# Altium schematic sheet DiPho_AFE.SchDoc: DiPho AFE
size 420 x 297 mm; Author: P. Daniel; CompanyName: WUT ISE; DrawnBy: P. Daniel; Organization: WUT ISE; Address1: WUT ISE; Address2: Nowowiejska 15/19 00-665 Warsaw; Address3: piotrmaciejdaniel@gmail.com; Revision: 2; SheetNumber: 1; SheetTotal: 3; ModifiedBy: -; CreateDate: 10-12.2021; CheckedDate: -; Title2: top schematic; DivGrp: WUT ISE; Designer: Piotr Daniel; ModifiedDate: -; ProjectName: Sensor Box
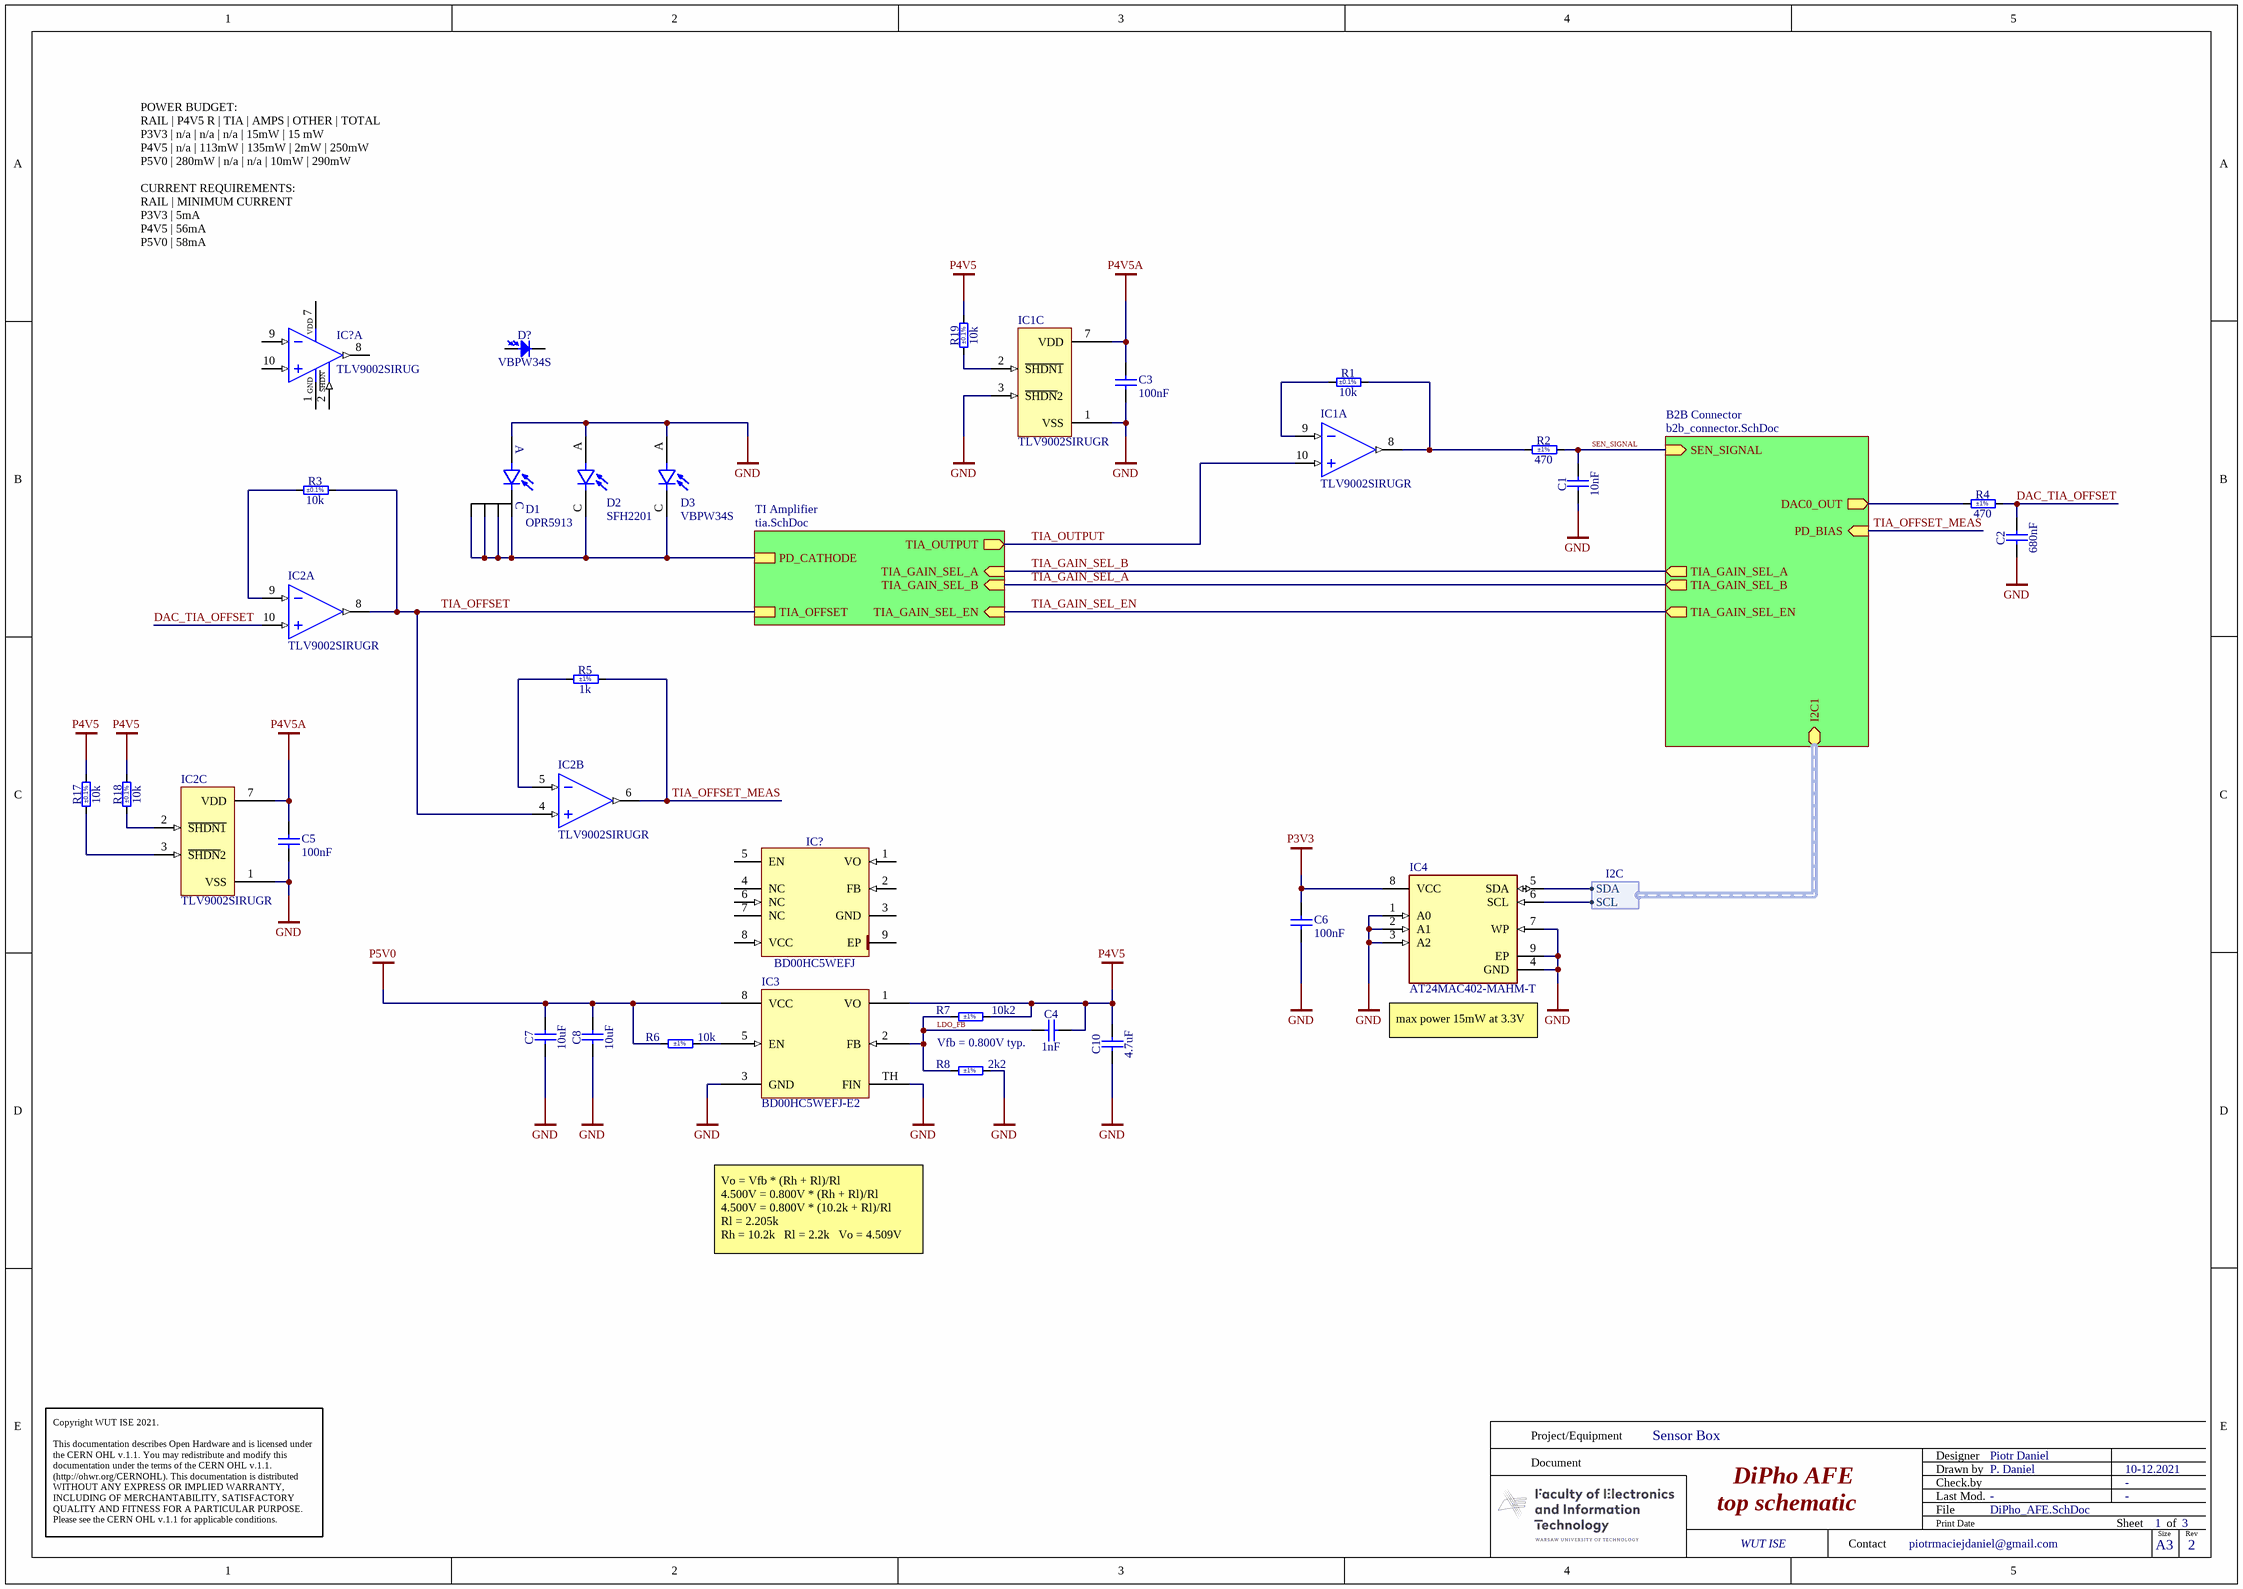
[diagram p0: DiPho_AFE.SchDoc]

## Parts
(Parts that share a designator on the sheet are numbered #1, #2 ... from top to bottom, then left to right.)
C1  10nF  [CAPC1005X55N]
C2  680nF  [CAPC1005X55N]
C3  100nF  [CAPC1005X55N]
C4  1nF  [CAPC1005X55N]
C5  100nF  [CAPC1005X55N]
C6  100nF  [CAPC1005X55N]
C7  10uF  [CAPC2012X135N]
C8  10uF  [CAPC2012X135N]
C10  4.7uF  [CAPC1709X95N]
D1  OPR5913  [LCCS249P899X899X167-8N]
D2  SFH2201  [SFH_2201]
D3  VBPW34S  [SOT0P705X130-2M]
D?  VBPW34S  [VISHAY_VBPW34S]
IC1  TLV9002SIRUGR  [QFN50P150X200X40-10N]  (parts A,C of 3)
IC2  TLV9002SIRUGR  [QFN50P150X200X40-10N]  (parts A,B,C of 3)
IC3  BD00HC5WEFJ-E2  [TSOP127P600X100_HS-9L]
IC4  AT24MAC402-MAHM-T  [FP-C04-21355-Q4B-MFG]
IC?#1  TLV9002SIRUG  [TEXAS_RUG (R-PQFP-N10)]  (part A of 2)
IC?#2  BD00HC5WEFJ  [SOIC127P600X170-9N-R240X310]
R1  10k  Tolerance: ±0.1%  [RESC1005X35N]
R2  470  Tolerance: ±1%  [RESC1005X40N]
R3  10k  Tolerance: ±0.1%  [RESC1005X35N]
R4  470  Tolerance: ±1%  [RESC1005X40N]
R5  1k  Tolerance: ±1%  [RESC1005X40N]
R6  10k  Tolerance: ±1%  [RESC1005X40N]
R7  10k2  Tolerance: ±1%  [RESC1005X40N]
R8  2k2  Tolerance: ±1%  [RESC1005X40N]
R17  10k  Tolerance: ±0.1%  [RESC1005X35N]
R18  10k  Tolerance: ±0.1%  [RESC1005X35N]
R19  10k  Tolerance: ±0.1%  [RESC1005X35N]

## Sub-sheets
B2B Connector = b2b_connector.SchDoc: TIA_GAIN_SEL_A (out), TIA_GAIN_SEL_B (out), I2C1 (bidir, harness I2C), TIA_GAIN_SEL_EN (out), SEN_SIGNAL (in), DAC0_OUT (out), PD_BIAS (in)
TI Amplifier = tia.SchDoc: PD_CATHODE, TIA_OUTPUT (out), TIA_GAIN_SEL_A (in), TIA_GAIN_SEL_B (in), TIA_OFFSET, TIA_GAIN_SEL_EN (in)

## Harnesses
I2C: SCL, SDA

## Nets
GND: C1.1 C2.1 C3.1 C5.1 C6.1 C7.1 C8.1 C10.1 D1.1(A) D2.A D3.A IC1.1(VSS) IC1.3(~{SHDN}2) IC2.1(VSS) IC3.3(GND) IC3.TH(FIN) IC4.1(A0) IC4.2(A1) IC4.3(A2) IC4.4(GND) IC4.7(WP) IC4.9(EP) R8.2
P3V3: C6.2 IC4.8(VCC)
P4V5: C4.2 C10.2 IC3.1(VO) R7.2 R17.2 R18.2 R19.2
P4V5A: C3.2 C5.2 IC1.7(VDD) IC2.7(VDD)
P5V0: C7.2 C8.2 IC3.8(VCC) R6.1
DAC_TIA_OFFSET: C2.2 IC2.10(IN+) R4.2
LDO_FB: C4.1 IC3.2(FB) R7.1 R8.1
SEN_SIGNAL: C1.2 R2.2 ; sheet B2B Connector/SEN_SIGNAL
TIA_GAIN_SEL_A: sheet TI Amplifier/TIA_GAIN_SEL_B, sheet B2B Connector/TIA_GAIN_SEL_B
TIA_GAIN_SEL_B: sheet TI Amplifier/TIA_GAIN_SEL_A, sheet B2B Connector/TIA_GAIN_SEL_A
TIA_GAIN_SEL_EN: sheet TI Amplifier/TIA_GAIN_SEL_EN, sheet B2B Connector/TIA_GAIN_SEL_EN
TIA_OFFSET: IC2.4(IN+) IC2.8(OUT) R3.2 ; sheet TI Amplifier/TIA_OFFSET
TIA_OFFSET_MEAS: IC2.6(OUT) R5.2 ; sheet B2B Connector/PD_BIAS
TIA_OUTPUT: IC1.10(IN+) ; sheet TI Amplifier/TIA_OUTPUT
NetD1_2: D1.2(C) D1.3(C) D1.6(C) D1.7(C) D2.C D3.C ; sheet TI Amplifier/PD_CATHODE
NetIC1_2: IC1.2(~{SHDN1}) R19.1
NetIC1_8: IC1.8(OUT) R1.2 R2.1
NetIC1_9: IC1.9(IN-) R1.1
NetIC2_2: IC2.2(~{SHDN1}) R18.1
NetIC2_3: IC2.3(~{SHDN}2) R17.1
NetIC2_5: IC2.5(IN-) R5.1
NetIC2_9: IC2.9(IN-) R3.1
NetIC3_5: IC3.5(EN) R6.2
NetIC4_5: IC4.5(SDA) ; sheet B2B Connector/I2C1.SDA
NetIC4_6: IC4.6(SCL) ; sheet B2B Connector/I2C1.SCL
NetR4_1: R4.1 ; sheet B2B Connector/DAC0_OUT

Not connected (* = marked no-connect by the designer): D? 1(C) 2(A); IC?#1 1(V-) 2(~{SHDN1}) 7(V+) 8(OUT1) 9(IN1-) 10(IN1+); IC?#2 1(VO) 2(FB) 3(GND) 4(NC) 5(EN) 6(NC) 7(NC) 8(VCC) 9(EP)

## Notes on the sheet
- POWER BUDGET:
  RAIL	| P4V5 R	| TIA	| AMPS	| OTHER	| TOTAL
  P3V3	| n/a	| n/a	| n/a	| 15mW	| 15 mW
  P4V5	| n/a	| 113mW	| 135mW	| 2mW	| 250mW
  P5V0	| 280mW	| n/a	| n/a	| 10mW	| 290mW
  CURRENT REQUIREMENTS:
  RAIL	| MINIMUM CURRENT
  P3V3	| 5mA
  P4V5	| 56mA
  P5V0	| 58mA
- (near C4) Vfb = 0.800V typ.
- (near IC4) max power 15mW at 3.3V
- Vo = Vfb * (Rh + Rl)/Rl
  4.500V = 0.800V * (Rh + Rl)/Rl
  4.500V = 0.800V * (10.2k + Rl)/Rl
  Rl = 2.205k
  Rh = 10.2k   Rl = 2.2k   Vo = 4.509V
- Project/Equipment
- Document
- Designer
- Drawn by
- Check.by
- Copyright WUT ISE 2021.
  This documentation describes Open Hardware and is licensed under the CERN OHL v.1.1. You may redistribute and modify this documentation under the terms of the CERN OHL v.1.1. (http://ohwr.org/CERNOHL). This documentation is distributed WITHOUT ANY EXPRESS OR IMPLIED WARRANTY, INCLUDING OF MERCHANTABILITY, SATISFACTORY QUALITY AND FITNESS FOR A PARTICULAR PURPOSE. Please see the CERN OHL v.1.1 for applicable conditions.
- Contact
- File
- Last Mod.
- Print Date
- Sheet
- Size
- A3
- of
- Rev
- (in symbol TLV9002SIRUG, part A) SHDN

## Library data of the parts
C1 = CC0402_10NF_16V_10%_X7R: Non-polarised capacitor; Part Description: SMD Multilayer Chip Ceramic Capacitor; Manufacturer: GENERIC; Manufacturer1 Part Number: 223878715636; Voltage: 16V; TC: X7R; Tolerance: ±10%; Part Number: CC0402_10NF_16V_10%_X7R; Component Kind: Standard; Component Type: Standard; Pin Count: 2; Value: 10nF; Status: Not Recommended; Manufacturer Part Number: CC0402_10NF_16V_10%_X7R; Case: 0402; Mounted: Yes; Socket: No; SMD: Yes; Sense: No; Manufacturer1 Example: PHYCOMP; Manufacturer1 ComponentHeight: 0.55mm; HelpURL: \\cern.ch\dfs\Applications\Altium\Datasheets\CC0402_X7R_PHYCOMP.pdf; Author: CERN DEM JLC; CreateDate: 03.12.2007; LatestRevisionDate: 03.12.2007
C2 = CC0402_680NF_10V_10%_X5R: Non-polarised capacitor; Part Description: SMD Multilayer Chip Ceramic Capacitor; Manufacturer: GENERIC; Manufacturer1 Part Number: GRM155R61A684KE15; Voltage: 10V; TC: X5R; Tolerance: ±10%; Part Number: CC0402_680NF_10V_10%_X5R; Component Kind: Standard; Component Type: Standard; Pin Count: 2; Value: 680nF; Status: None; Manufacturer Part Number: CC0402_680NF_10V_10%_X5R; Case: 0402; Mounted: Yes; Socket: No; SMD: Yes; Sense: No; Manufacturer1 Example: MURATA; Manufacturer1 ComponentHeight: 0.55mm; HelpURL: \\cern.ch\dfs\Applications\Altium\Datasheets\CC0402_X5R_MURATA_GRM.pdf; Author: CERN DEM BC; CreateDate: 19.04.2021; LatestRevisionDate: 19.04.2021
C3 C5 C6 = CC0402_100NF_16V_10%_X7R: Non-polarised capacitor; Manufacturer: GENERIC; Part Description: SMD Multilayer Chip Ceramic Capacitor; Manufacturer1 Part Number: GRM155R71C104KA88D; Tolerance: ±10%; Voltage: 16V; TC: X7R; Part Number: CC0402_100NF_16V_10%_X7R; Component Kind: Standard; Component Type: Standard; Pin Count: 2; Value: 100nF; Status: Not Recommended; Manufacturer Part Number: CC0402_100NF_16V_10%_X7R; Case: 0402; Mounted: Yes; Socket: No; SMD: Yes; Sense: No; Manufacturer1 Example: MURATA; Manufacturer1 ComponentHeight: 0.55mm; HelpURL: \\cern.ch\dfs\Applications\Altium\Datasheets\CC0402_X7R_MURATA_GRM.pdf; Author: CERN DEM JLC; CreateDate: 05.12.2013; LatestRevisionDate: 03.12.2007
C4 = CC0402_1NF_50V_10%_X7R: Non-polarised capacitor; Part Description: SMD Multilayer Chip Ceramic Capacitor; Manufacturer: GENERIC; Manufacturer1 Part Number: 223858715623; Voltage: 50V; TC: X7R; Tolerance: ±10%; Part Number: CC0402_1NF_50V_10%_X7R; Component Kind: Standard; Component Type: Standard; Pin Count: 2; Value: 1nF; Status: Not Recommended; Manufacturer Part Number: CC0402_1NF_50V_10%_X7R; Case: 0402; Mounted: Yes; Socket: No; SMD: Yes; Sense: No; Manufacturer1 Example: PHYCOMP; Manufacturer1 ComponentHeight: 0.55mm; HelpURL: \\cern.ch\dfs\Applications\Altium\Datasheets\CC0402_X7R_PHYCOMP.pdf; Author: CERN DEM JLC; CreateDate: 03.12.2007; LatestRevisionDate: 03.12.2007
C7 C8 = CC0805_10UF_10V_10%_X7R: Non-polarised capacitor; Part Description: SMD Multilayer Chip Ceramic Capacitor; Manufacturer: GENERIC; Manufacturer1 Part Number: GRM21BR71A106KE51L; Voltage: 10V; TC: X7R; Tolerance: ±10%; Part Number: CC0805_10UF_10V_10%_X7R; Component Kind: Standard; Component Type: Standard; Pin Count: 2; Value: 10uF; Status: Preferred; Manufacturer Part Number: CC0805_10UF_10V_10%_X7R; Case: 0805; Mounted: Yes; Socket: No; SMD: Yes; Sense: No; Manufacturer1 Example: MURATA; Manufacturer1 ComponentHeight: 1.35mm; HelpURL: \\cern.ch\dfs\Applications\Altium\Datasheets\CC0805_X7R_MURATA.pdf; Author: CERN DEM JLC; CreateDate: 30.04.2012; LatestRevisionDate: 30.04.2012
C10 = CC0603_4.7UF_16V_10%_X5R: Non-polarised capacitor; Part Description: SMD Multilayer Chip Ceramic Capacitor; Manufacturer: GENERIC; Manufacturer1 Part Number: EMK107ABJ475KA-T; Voltage: 16V; TC: X5R; Tolerance: ±10%; Part Number: CC0603_4.7UF_16V_10%_X5R; Component Kind: Standard; Component Type: Standard; Pin Count: 2; Value: 4.7uF; Status: None; Manufacturer Part Number: CC0603_4.7UF_16V_10%_X5R; Case: 0603; Mounted: Yes; Socket: No; SMD: Yes; Sense: No; Manufacturer1 Example: TAIYO YUDEN; Manufacturer1 ComponentHeight: 0.95mm; HelpURL: \\cern.ch\dfs\Applications\Altium\Datasheets\CC0603_X7R_TAIYO-YUDEN_HIGH-VALUE.pdf; Author: CERN DEM JLC; CreateDate: 16.12.2013; LatestRevisionDate: 16.09.2014
D1 = OPR5913: Surface mount PIN photodiode, SMD-8, RoHS; Manufacturer: TT Optek; Wavelength: 880nm; Dark Current: 100nA; Max Reverse Voltage (DC): 10V; Responsivity: 0.4A/W; Supplier 1: Newark; Manufacturer Part Number: OPR5913; RoHS: Yes; Category: Optical Sensors; Pricing 1: 1=17,31000, 10=16,18000, 25=15,70000, 50=14,18000, 100=13,35000, 250=11,75000 (USD); Mount: Surface Mount; Case/Package: SMD/SMT; Number of Pins: 8; Min Operating Temperature: -55°C; Max Operating Temperature: 125°C; Packaging: Tray; Package Quantity: 25; Diode Type: PIN; Reverse Voltage: 10V; RoHS Compliant: Yes; ComponentLink1URL: https://datasheet.ciiva.com/2820/opr5910-5913-5915-2820071.pdf?src-supplier=Digi-Key; ComponentLink1Description: https://datasheet.ciiva.com/2820/opr5910-5913-5915-2820071.pdf?src-supplier=Digi-Key; Supplier Part Number 1: 09AK6399
D3 = VBPW34S: IR-photodiode Photoelectric current: 45...55 uA Wavelength of max. photosensitivity: 940 nm; Manufacturer: Vishay; Wavelength: 940nm; Rise Time: 100ns; Dark Current: 2nA; Viewing Angle: 130°; Reverse Breakdown Voltage: 60V; Power Dissipation: 215mW; Diode Type: PIN; Forward Voltage: 1.3V; Forward Current: 50mA; Supplier 1: Farnell; Manufacturer Part Number: VBPW34S; RoHS: Yes; Category: Photodiodes; Mount: Surface Mount,PCB; Case/Package: SMD/SMT; Number of Pins: 2; Contact Plating: Tin; Min Operating Temperature: -40°C; Max Operating Temperature: 100°C; Packaging: Tape and Reel; Fall Time: 100ns; Package Quantity: 1; Max Reverse Voltage (DC): 60V; Response Time: 100ns; Max Power Dissipation: 215mW; Reverse Voltage (DC): 60V; Series: -; Breakdown Voltage: 60V; Length: 4.4mm; Width: 3.9mm; Height: 1.2mm; Radiation Hardening: No; REACH SVHC: Unknown; RoHS Compliant: Yes; Lead Free: Lead Free; ComponentLink1URL: https://datasheet.ciiva.com/2819/vbpw34s-2819712.pdf?src-supplier=Digi-Key; ComponentLink1Description: https://datasheet.ciiva.com/2819/vbpw34s-2819712.pdf?src-supplier=Digi-Key; ComponentLink2URL: https://datasheet.ciiva.com/1336/485095-1336336.pdf?src-supplier=Newark; ComponentLink2Description: https://datasheet.ciiva.com/1336/485095-1336336.pdf?src-supplier=Newark; ComponentLink3URL: https://datasheet.ciiva.com/26941/getdatasheetpartid-402658-26941846.pdf?src-supplier=Verical; ComponentLink3Description: https://datasheet.ciiva.com/26941/getdatasheetpartid-402658-26941846.pdf?src-supplier=Verical; ComponentLink4URL: https://datasheet.ciiva.com/4697/vbpw34s-75683-4697656.pdf?src-supplier=Mouser; ComponentLink4Description: https://datasheet.ciiva.com/4697/vbpw34s-75683-4697656.pdf?src-supplier=Mouser; ComponentLink5URL: https://datasheet.ciiva.com/4270/2vbpw34s-4270116.pdf?src-supplier=Arrow+Electronics; ComponentLink5Description: https://datasheet.ciiva.com/4270/2vbpw34s-4270116.pdf?src-supplier=Arrow+Electronics; ComponentLink6URL: https://datasheet.ciiva.com/1249/vbpw34s-1249217.pdf?src-supplier=Element14; ComponentLink6Description: https://datasheet.ciiva.com/1249/vbpw34s-1249217.pdf?src-supplier=Element14; ComponentLink7URL: https://datasheet.ciiva.com/1249/485095-1249011.pdf?src-supplier=Element14; ComponentLink7Description: https://datasheet.ciiva.com/1249/485095-1249011.pdf?src-supplier=Element14; ComponentLink8URL: https://datasheet.ciiva.com/9218/vbpw34s-9218633.pdf?src-supplier=Avnet; ComponentLink8Description: https://datasheet.ciiva.com/9218/vbpw34s-9218633.pdf?src-supplier=Avnet; ComponentLink9URL: https://datasheet.ciiva.com/2819/vbpw34s-2819710.pdf?src-supplier=Digi-Key; ComponentLink9Description: https://datasheet.ciiva.com/2819/vbpw34s-2819710.pdf?src-supplier=Digi-Key; ComponentLink10URL: https://datasheet.ciiva.com/2819/vbpw34s-2819711.pdf?src-supplier=Digi-Key; ComponentLink10Description: https://datasheet.ciiva.com/2819/vbpw34s-2819711.pdf?src-supplier=Digi-Key; ComponentLink11URL: https://datasheet.ciiva.com/46390/1809628-46390726.pdf?src-supplier=Element14; ComponentLink11Description: https://datasheet.ciiva.com/46390/1809628-46390726.pdf?src-supplier=Element14; Supplier Part Number 1: 1779702
D? = VBPW34S: Photodiode; Part Description: SMT Silicon PIN Photodiode, Photosensitive Area 3.00 x 3.00 mm; Manufacturer: VISHAY SEMICONDUCTORS; PressFit: No; Bonding: No; Part Number: VBPW34S; Component Kind: Standard; Component Type: Standard; Device: VBPW34S; PackageDescription: SMT Silicon PIN Photodiode, Photosensitive Area 3.00 x 3.00 mm; Manufacturer Part Number: VBPW34S; Pin Count: 2; Mounted: Yes; Socket: No; SMD: Yes; Sense: No; ComponentHeight: 1.4mm; HelpURL: \\cern.ch\dfs\Applications\Altium\Datasheets\VBPW34S.pdf; Author: CERN DEM HF; CreateDate: 13.02.2025; LatestRevisionDate: 13.02.2025
IC1 IC2 = TLV9002SIRUGR: Rail-to-Rail Input/Output Operational Amplifier Dual 1.8V to 5.5V 10-Pin X2QFN T/R; Manufacturer: Texas Instruments; Supplier 1: Digi-Key; Manufacturer Part Number: TLV9002SIRUGR; RoHS: Yes; Category: Amplifiers - Op Amps, Buffer, Instrumentation; Stock 1: 2771; Pricing 1: 1=0,89000, 10=0,78400, 25=0,73600, 100=0,60070, 250=0,55800, 500=0,47488, 1000=0,37990 (USD); Supplier Part Number 1: 296-TLV9002SIRUGRCT-ND
IC3 = BD00HC5WEFJ-E2: LDO Regulator Pos 0.8V to 4.5V 1.5A 8-Pin HTSOP-J EP T/R; Manufacturer: Rohm; Dropout Voltage: 600mV; Number of Outputs: 1; Max Input Voltage: 8V; Output Voltage: 7V; Max Power Dissipation: 2.11W; Output Type: Adjustable; Min Output Voltage: 1.5V; Supplier 1: RSComponents; Manufacturer Part Number: BD00HC5WEFJ-E2; RoHS: Yes; Category: Voltage Regulators - Linear; Stock 1: 2500; Mount: Surface Mount; Number of Pins: 8; Contact Plating: Copper,Tin; Min Operating Temperature: -25°C; Max Operating Temperature: 85°C; Package Quantity: 1; Packaging: Tape and Reel; Output Current: 1.5A; Min Input Voltage: 4.5V; Max Output Current: 1.5A; Number of Regulators: 1; Max Output Voltage: 7V; Series: -; REACH SVHC: Unknown; RoHS Compliant: Yes; Lead Free: Lead Free; ComponentLink1URL: https://datasheet.ciiva.com/23909/1747247-23909522.pdf?src-supplier=Newark; ComponentLink1Description: https://datasheet.ciiva.com/23909/1747247-23909522.pdf?src-supplier=Newark; ComponentLink2URL: https://datasheet.ciiva.com/2040/bd00hc5wefj-e-2040163.pdf?src-supplier=Digi-Key; ComponentLink2Description: https://datasheet.ciiva.com/2040/bd00hc5wefj-e-2040163.pdf?src-supplier=Digi-Key; ComponentLink3URL: https://datasheet.ciiva.com/13009/bd00hc5wefj-e-210854-13009750.pdf?src-supplier=Mouser; ComponentLink3Description: https://datasheet.ciiva.com/13009/bd00hc5wefj-e-210854-13009750.pdf?src-supplier=Mouser; ComponentLink4URL: https://datasheet.ciiva.com/22732/1747247-22732891.pdf?src-supplier=Element14; ComponentLink4Description: https://datasheet.ciiva.com/22732/1747247-22732891.pdf?src-supplier=Element14; Supplier Part Number 1: 1780037
IC4 = CMP-06313-000089-1: IC EEPROM 2K I2C 1MHZ 8UDFN; Memory Size: 2Kb; Access Time: 550ns; Memory Type: Non-Volatile; Max Operating Temperature: 85°C; Frequency: 1MHz; Min Operating Temperature: -40°C; Packaging: Cut Tape; RoHS Compliant: Yes; Mount: Surface Mount
IC?#1 = TLV9002SIRUG: 500uA, 3MHz Rail-to-Rail Input/Output Operational Amplifier With Shutdown; Part Description: Low-Power, RRIO, 1-MHz Operational Amplifier for Cost-Sensitive Systems; Manufacturer: TEXAS INSTRUMENTS; PressFit: No; Bonding: No; Part Number: TLV9002SIRUG; Component Kind: Standard; Component Type: Standard; Device: TLV9002SIRUG; PackageDescription: QFN, TEXAS Case Style RUG (R-PQFP-N10), 0.50mm Pitch; 10 Pin, 1.50mm W  X 2.00mm L X 0.40mm H body; Manufacturer Part Number: TLV9002SIRUG; Pin Count: 10; Case: QFN10; Mounted: Yes; Socket: No; SMD: Yes; Sense: No; ComponentHeight: 0.4mm; Author: CERN DEM HF; HelpURL: \\cern.ch\dfs\Applications\Altium\Datasheets\TLV900X.pdf; CreateDate: 14.02.2025; LatestRevisionDate: 14.02.2025
IC?#2 = BD00HC5WEFJ: 4.5V to 8.0V Input, 1.5A Variable LDO Regulators; Manufacturer: ROHM; PressFit: No; Bonding: No; Part Number: BD00HC5WEFJ; Component Kind: Standard; Component Type: Standard; Device: BD00HC5WEFJ; PackageDescription: SOIC, 1.27mm Pitch; 8 Pin, 3.90mm W X 4.90mm L X 1.70mm H body (w/Thermal Tab 2.40 X 3.10mm), IPC Medium Density; Part Description: 4.5V to 8.0V Input, 1.5A Variable LDO Regulators; Manufacturer Part Number: BD00HC5WEFJ; Pin Count: 9; Case: SOIC8; Mounted: Yes; Socket: No; SMD: Yes; Sense: No; ComponentHeight: 1mm; HelpURL: \\cern.ch\dfs\Applications\Altium\Datasheets\BDxxHC5WEFJ.pdf; Author: CERN DEM HF; CreateDate: 14.02.2025; LatestRevisionDate: 14.10.2022
R1 R3 R17-R19 = R0402_10K_0.1%_0.063W_25PPM: Resistor - 0.1%; Part Description: Thin Film Precision Resistor; Manufacturer: GENERIC; Manufacturer1 Part Number: CPF0402B10KE1; Power: 0.063W; TC: ±25ppm/°C; PressFit: No; Part Number: R0402_10K_0.1%_0.063W_25PPM; Component Kind: Standard; Component Type: Standard; Pin Count: 2; Value: 10k; Status: Not Recommended; Manufacturer Part Number: R0402_10K_0.1%_0.063W_25PPM; Case: 0402; Mounted: Yes; Sense: No; Socket: No; SMD: Yes; Manufacturer1 Example: TE CONNECTIVITY; Manufacturer1 ComponentHeight: 0.35mm; HelpURL: \\cern.ch\dfs\Applications\Altium\Datasheets\R0402_TYCO_CPF.pdf; Author: CERN DEM JMW; CreateDate: 22.09.2015; LatestRevisionDate: 22.09.2015
R2 R4 = R0402_470R_1%_0.0625W_100PPM: Resistor - 1%; Part Description: General Purpose Thick Film Chip Resistor; Manufacturer: GENERIC; Manufacturer1 Part Number: 232270674701L; TC: ±100ppm/°C; PressFit: No; Part Number: R0402_470R_1%_0.0625W_100PPM; Component Kind: Standard; Component Type: Standard; Pin Count: 2; Value: 470; Status: Not Recommended; Power: 0.0625W; Manufacturer Part Number: R0402_470R_1%_0.0625W_100PPM; Case: 0402; Mounted: Yes; Sense: No; Socket: No; SMD: Yes; Manufacturer1 Example: YAGEO PHYCOMP; Manufacturer1 ComponentHeight: 0.4mm; HelpURL: \\cern.ch\dfs\Applications\Altium\Datasheets\R0402_Phycomp_RC0402.pdf; Author: CERN DEM JLC; CreateDate: 03.12.2007; LatestRevisionDate: 17.10.2012
R5 = R0402_1K_1%_0.0625W_100PPM: Resistor - 1%; Part Description: General Purpose Thick Film Chip Resistor; Manufacturer: GENERIC; Manufacturer1 Part Number: 232270671002L; TC: ±100ppm/°C; PressFit: No; Part Number: R0402_1K_1%_0.0625W_100PPM; Component Kind: Standard; Component Type: Standard; Pin Count: 2; Value: 1k; Status: Not Recommended; Power: 0.0625W; Manufacturer Part Number: R0402_1K_1%_0.0625W_100PPM; Case: 0402; Mounted: Yes; Sense: No; Socket: No; SMD: Yes; Manufacturer1 Example: YAGEO PHYCOMP; Manufacturer1 ComponentHeight: 0.4mm; HelpURL: \\cern.ch\dfs\Applications\Altium\Datasheets\R0402_Phycomp_RC0402.pdf; Author: CERN DEM JLC; CreateDate: 03.12.2007; LatestRevisionDate: 17.10.2012
R6 = R0402_10K_1%_0.0625W_100PPM: Resistor - 1%; Part Description: General Purpose Thick Film Chip Resistor; Manufacturer: GENERIC; Manufacturer1 Part Number: 232270671003L; TC: ±100ppm/°C; PressFit: No; Part Number: R0402_10K_1%_0.0625W_100PPM; Component Kind: Standard; Component Type: Standard; Pin Count: 2; Value: 10k; Status: Not Recommended; Power: 0.0625W; Manufacturer Part Number: R0402_10K_1%_0.0625W_100PPM; Case: 0402; Mounted: Yes; Sense: No; Socket: No; SMD: Yes; Manufacturer1 Example: YAGEO PHYCOMP; Manufacturer1 ComponentHeight: 0.4mm; HelpURL: \\cern.ch\dfs\Applications\Altium\Datasheets\R0402_Phycomp_RC0402.pdf; Author: CERN DEM JLC; CreateDate: 03.12.2007; LatestRevisionDate: 17.10.2012
R7 = R0402_10K_1%_0.0625W_100PPM: Resistor - 1%; Part Number: R0402_10K2_1%_0.0625W_100PPM; Part Description: General Purpose Thick Film Chip Resistor; Manufacturer: GENERIC; TC: ±100ppm/°C; PressFit: No; Component Kind: Standard; Component Type: Standard; Pin Count: 2; Value: 10k2; Status: Not Recommended; Power: 0.0625W; Manufacturer Part Number: R0402_10K2_1%_0.0625W_100PPM; Case: 0402; Mounted: Yes; Sense: No; Socket: No; SMD: Yes; Manufacturer1 ComponentHeight: 0.4mm; HelpURL: \\cern.ch\dfs\Applications\Altium\Datasheets\R0402_Phycomp_RC0402.pdf; Author: CERN DEM JLC; CreateDate: 03.12.2007; LatestRevisionDate: 17.10.2012
R8 = R0402_2K2_1%_0.0625W_100PPM: Resistor - 1%; Part Description: General Purpose Thick Film Chip Resistor; Manufacturer: GENERIC; Manufacturer1 Part Number: 232270672202L; TC: ±100ppm/°C; PressFit: No; Part Number: R0402_2K2_1%_0.0625W_100PPM; Component Kind: Standard; Component Type: Standard; Pin Count: 2; Value: 2k2; Status: Not Recommended; Power: 0.0625W; Manufacturer Part Number: R0402_2K2_1%_0.0625W_100PPM; Case: 0402; Mounted: Yes; Sense: No; Socket: No; SMD: Yes; Manufacturer1 Example: YAGEO PHYCOMP; Manufacturer1 ComponentHeight: 0.4mm; HelpURL: \\cern.ch\dfs\Applications\Altium\Datasheets\R0402_Phycomp_RC0402.pdf; Author: CERN DEM JLC; CreateDate: 03.12.2007; LatestRevisionDate: 17.10.2012